# EAGLE schematic MainFeeder_V1.0 (EAGLE 9.5.2)
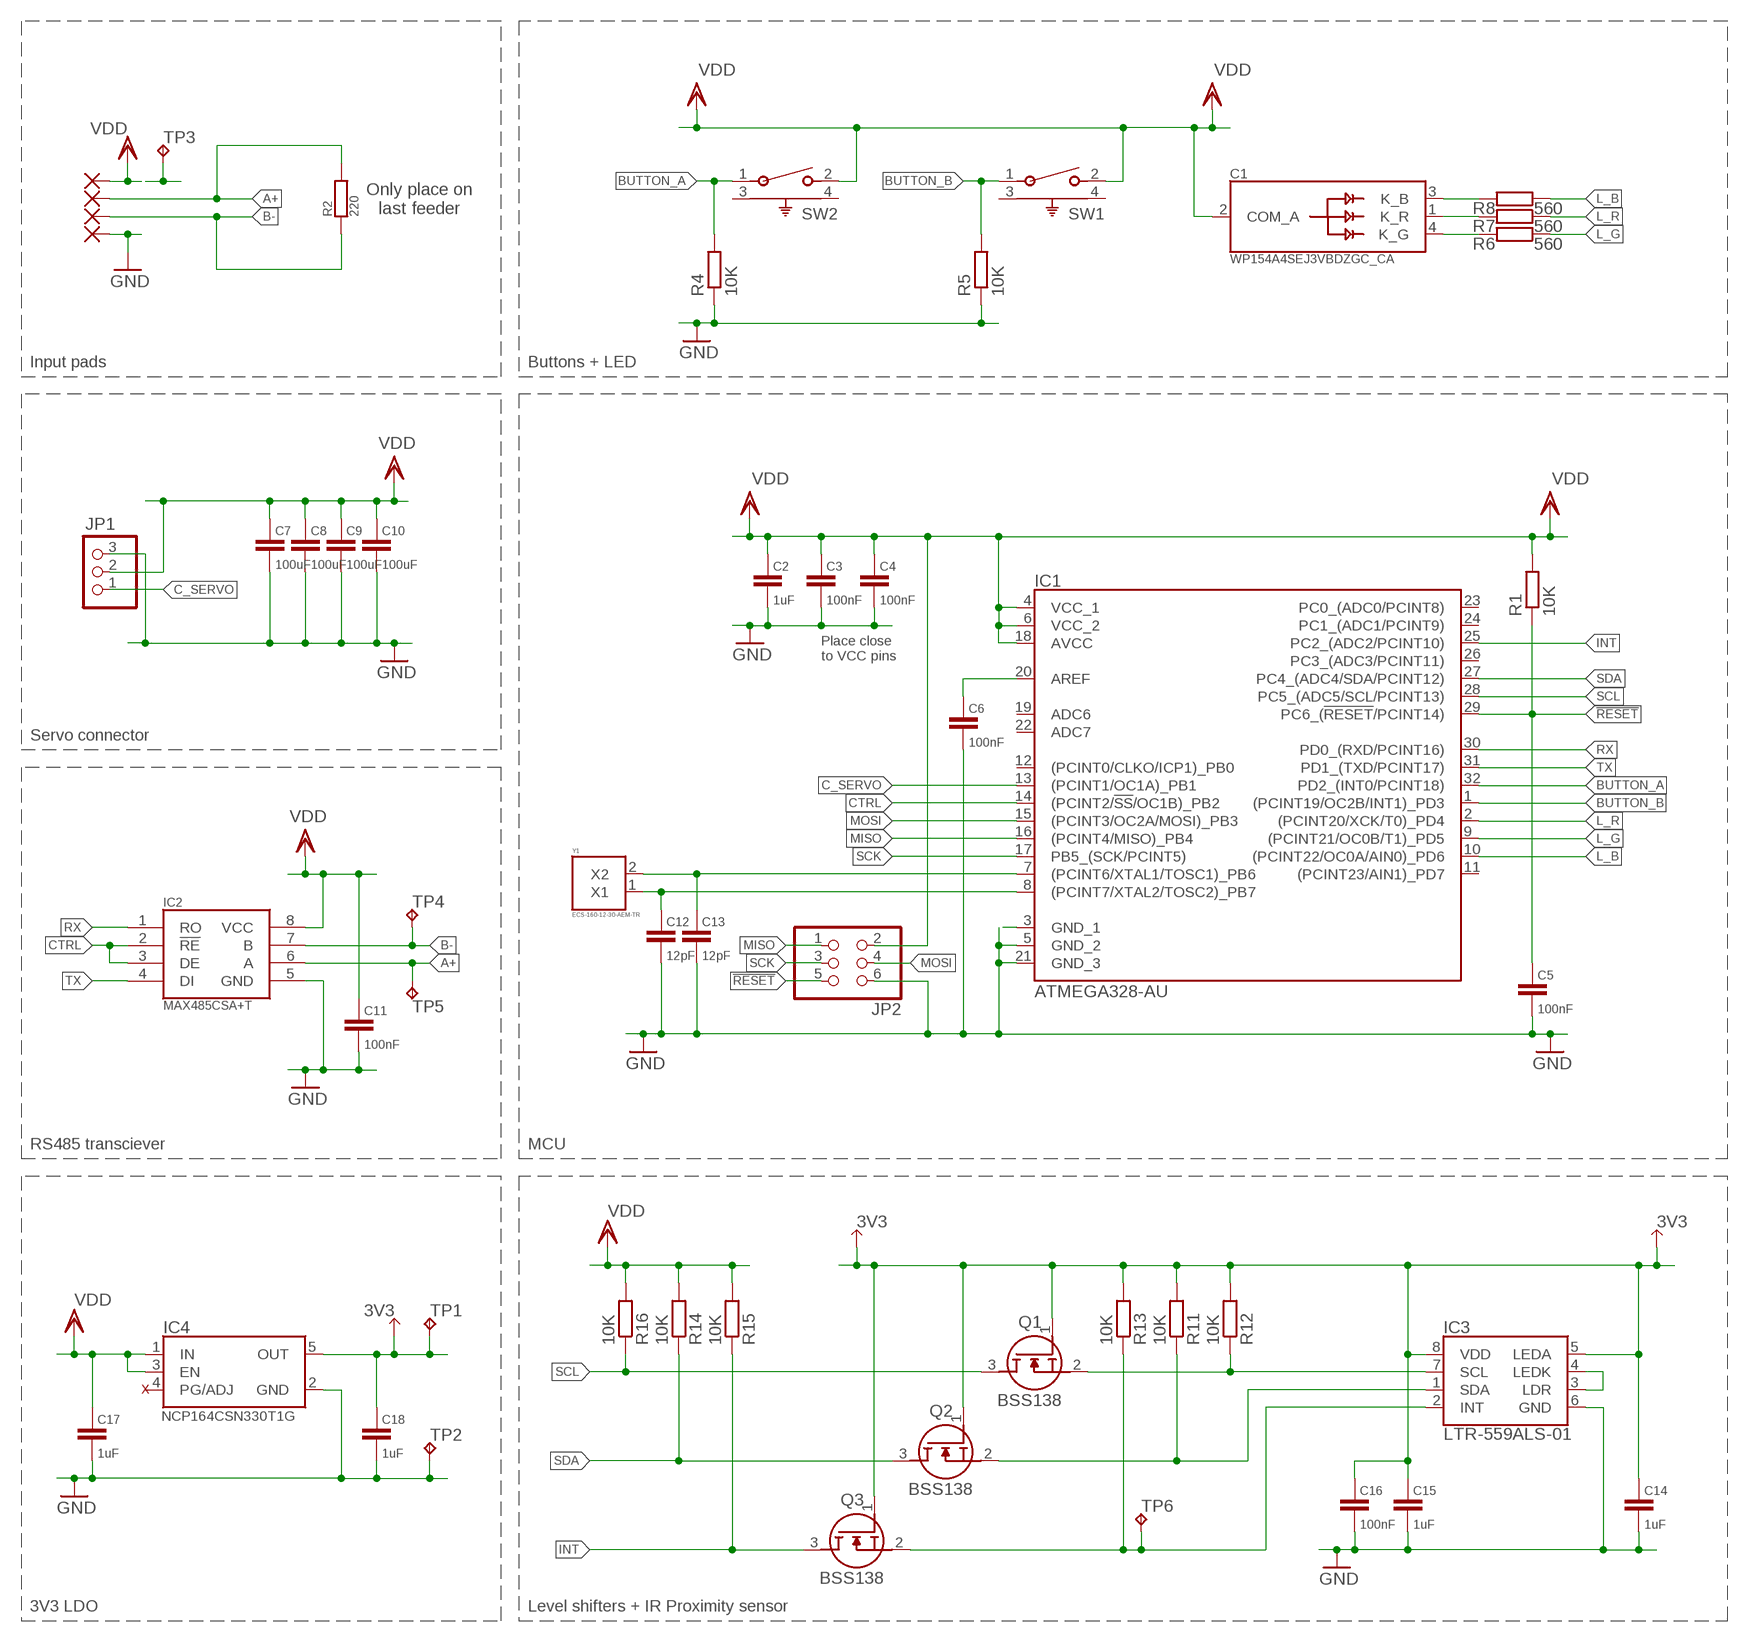
[diagram p0: schematic, sheet 1]

## Parts
C1  WP154A4SEJ3VBDZGC_CA  [L-154A4SUREQBFZGEC]
C2  1uF  C-EUC0603  [C0603]
C3  100nF  C-EUC0603  [C0603]
C4  100nF  C-EUC0603  [C0603]
C5  100nF  C-EUC0603  [C0603]
C6  100nF  C-EUC0603  [C0603]
C7  100uF  C-EUC0805  [C0805]
C8  100uF  C-EUC0805  [C0805]
C9  100uF  C-EUC0805  [C0805]
C10  100uF  C-EUC0805  [C0805]
C11  100nF  C-EUC0603  [C0603]
C12  12pF  C-EUC0603  [C0603]
C13  12pF  C-EUC0603  [C0603]
C14  1uF  C-EUC0603  [C0603]
C15  1uF  C-EUC0603  [C0603]
C16  100nF  C-EUC0603  [C0603]
C17  1uF  C-EUC0603  [C0603]
C18  1uF  C-EUC0603  [C0603]
IC1  ATMEGA328-AU  [QFP80P900X900X120-32N]
IC2  MAX485CSA+T  [SOIC127P600X175-8N]
IC3  LTR-559ALS-01  [LTR559ALS01]
IC4  NCP164CSN330T1G  [SOT95P275X110-5N]
JP1  PINHD-1X3/90  [1X03/90]
JP2  PINHD-2X3  [2X03]
PAD1  SMD2  [SMD1,27-2,54]
PAD2  SMD2  [SMD1,27-2,54]
PAD3  SMD2  [SMD1,27-2,54]
PAD4  SMD2  [SMD1,27-2,54]
Q1  BSS138  [SOT95P240X120-3N]
Q2  BSS138  [SOT95P240X120-3N]
Q3  BSS138  [SOT95P240X120-3N]
R1  10K  R-EU_R0603  [R0603]
R2  220  R-EU_R0603  [R0603]
R4  10K  R-EU_R0603  [R0603]
R5  10K  R-EU_R0603  [R0603]
R6  560  R-EU_R0603  [R0603]
R7  560  R-EU_R0603  [R0603]
R8  560  R-EU_R0603  [R0603]
R11  10K  R-EU_R0603  [R0603]
R12  10K  R-EU_R0603  [R0603]
R13  10K  R-EU_R0603  [R0603]
R14  10K  R-EU_R0603  [R0603]
R15  10K  R-EU_R0603  [R0603]
R16  10K  R-EU_R0603  [R0603]
SW1  1-1825027-1  [SW2_1825027-A_TEC]
SW2  1-1825027-1  [SW2_1825027-A_TEC]
TP1  TPB1,27  [B1,27]
TP2  TPB1,27  [B1,27]
TP3  TPB1,27  [B1,27]
TP4  TPB1,27  [B1,27]
TP5  TPB1,27  [B1,27]
TP6  TPB1,27  [B1,27]
Y1  ECS-160-12-30-AEM-TR  [ECS1601230AEMTR]

## Nets
3V3: C14.1 C15.1 C16.1 C18.1 IC3.5(LEDA) IC3.8(VDD) IC4.5(OUT) Q1.1(G) Q2.1(G) Q3.1(G) R11.2 R12.2 R13.2 TP1.TP
!RESET: C5.1 IC1.29(PC6_(!RESET!/PCINT14)) JP2.5 R1.1
A+: IC2.6(A) PAD1.1(P) R2.2 TP5.TP
B-: IC2.7(B) PAD2.1(P) R2.1 TP4.TP
BUTTON_A: IC1.32(PD2_(INT0/PCINT18)) R4.2 SW2.1
BUTTON_B: IC1.1((PCINT19/OC2B/INT1)_PD3) R5.2 SW1.1
C_SERVO: IC1.13((PCINT1/OC1A)_PB1) JP1.1
CTRL: IC1.14((PCINT2/!SS!/OC1B)_PB2) IC2.2(!RE) IC2.3(DE)
GND: C2.2 C3.2 C4.2 C5.2 C6.2 C7.2 C8.2 C9.2 C10.2 C11.2 C12.2 C13.2 C14.2 C15.2 C16.2 C17.2 C18.2 IC1.3(GND_1) IC1.5(GND_2) IC1.21(GND_3) IC2.5(GND) IC3.6(GND) IC4.2(GND) JP1.3 JP2.6 PAD3.1(P) R4.1 R5.1 TP2.TP
INT: IC1.25(PC2_(ADC2/PCINT10)) Q3.3(D) R15.1
INT_3V3: IC3.2(INT) Q3.2(S) R13.1 TP6.TP
L_B: IC1.10((PCINT22/OC0A/AIN0)_PD6) R8.1
L_G: IC1.9((PCINT21/OC0B/T1)_PD5) R6.1
L_R: IC1.2((PCINT20/XCK/T0)_PD4) R7.1
MISO: IC1.16((PCINT4/MISO)_PB4) JP2.1
MOSI: IC1.15((PCINT3/OC2A/MOSI)_PB3) JP2.4
N$1: C6.1 IC1.20(AREF)
N$2: C1.3(K_B) R8.2
N$3: C1.1(K_R) R7.2
N$4: IC3.3(LDR) IC3.4(LEDK)
N$6: C12.1 IC1.8((PCINT7/XTAL2/TOSC2)_PB7) Y1.1(X1)
N$7: C1.4(K_G) R6.2
N$8: C13.1 IC1.7((PCINT6/XTAL1/TOSC1)_PB6) Y1.2(X2)
RX: IC1.30(PD0_(RXD/PCINT16)) IC2.1(RO)
SCK: IC1.17(PB5_(SCK/PCINT5)) JP2.3
SCL: IC1.28(PC5_(ADC5/SCL/PCINT13)) Q1.3(D) R16.1
SCL_3V3: IC3.7(SCL) Q1.2(S) R12.1
SDA: IC1.27(PC4_(ADC4/SDA/PCINT12)) Q2.3(D) R14.1
SDA_3V3: IC3.1(SDA) Q2.2(S) R11.1
TX: IC1.31(PD1_(TXD/PCINT17)) IC2.4(DI)
VDD: C1.2(COM_A) C2.1 C3.1 C4.1 C7.1 C8.1 C9.1 C10.1 C11.1 C17.1 IC1.4(VCC_1) IC1.6(VCC_2) IC1.18(AVCC) IC2.8(VCC) IC4.1(IN) IC4.3(EN) JP1.2 JP2.2 PAD4.1(P) R1.2 R14.2 R15.2 R16.2 SW1.2 SW2.2 TP3.TP
Unconnected: IC1.11((PCINT23/AIN1)_PD7) IC1.12((PCINT0/CLKO/ICP1)_PB0) IC1.19(ADC6) IC1.22(ADC7) IC1.23(PC0_(ADC0/PCINT8)) IC1.24(PC1_(ADC1/PCINT9)) IC1.26(PC3_(ADC3/PCINT11)) IC4.4(PG/ADJ) SW1.3 SW1.4 SW2.3 SW2.4

## Notes on the sheet
- Only place on
  last feeder
- Input pads | Buttons + LED
- Place close
  to VCC pins
- Servo connector
- RS485 transciever | MCU
- X
- 3V3 LDO | Level shifters + IR Proximity sensor

## Library data of the parts
C1 = SamacSys_Parts:WP154A4SEJ3VBDZGC_CA: Standard LEDs - Through Hole 5MM RGB LED Source: Datasheet <http://www.kingbrightusa.com/images/catalog/SPEC/WP154A4SEJ3VBDZGC-CA.pdf>; DESCRIPTION: Standard LEDs - Through Hole 5MM RGB LED; HEIGHT: mm; MANUFACTURER_NAME: Kingbright; MANUFACTURER_PART_NUMBER: WP154A4SEJ3VBDZGC/CA; MOUSER_PART_NUMBER: 604-WP154A43VBDZGCCA; MOUSER_PRICE-STOCK: https://www.mouser.co.uk/ProductDetail/Kingbright/WP154A4SEJ3VBDZGC-CA?qs=YCa%2FAAYMW01T13YiwBKGSw%3D%3D
C2-C18 = rcl:C-EU: CAPACITOR, European symbol; SPICEPREFIX: C
IC1 = SamacSys_Parts:ATMEGA328-AU: MCU 8-Bit AVR 32KB Flash 2.5/3.3/5V ATMEGA328-AU, 8 bit AVR Microcontroller 20MHz 32 kB Flash, 1 kB, 2 kB RAM, I2C 32-Pin TQFP Source: Datasheet <http://www.atmel.com/images/atmel-8271-8-bit-avr-microcontroller-atmega48a-48pa-88a-88pa-168a-168pa-328-328p_datasheet_summary.pdf>; DESCRIPTION: MCU 8-Bit AVR 32KB Flash 2.5/3.3/5V ATMEGA328-AU, 8 bit AVR Microcontroller 20MHz 32 kB Flash, 1 kB, 2 kB RAM, I2C 32-Pin TQFP; HEIGHT: 1.2mm; MANUFACTURER_NAME: Microchip; MANUFACTURER_PART_NUMBER: ATMEGA328-AU; MOUSER_PART_NUMBER: 556-ATMEGA328-AU; MOUSER_PRICE-STOCK: https://www.mouser.co.uk/ProductDetail/Microchip-Technology-Atmel/ATMEGA328-AU?qs=lwdSMh1%2FoYJRHuGBjWz9Pg%3D%3D
IC2 = SamacSys_Parts:MAX485CSA+T: RS-422/RS-485 Interface IC Low-Power, Slew-Rate-Limited RS-485/RS-422 Transceivers Source: Datasheet <https://datasheets.maximintegrated.com/en/ds/MAX1487-MAX491.pdf>; DESCRIPTION: RS-422/RS-485 Interface IC Low-Power, Slew-Rate-Limited RS-485/RS-422 Transceivers; HEIGHT: 1.75mm; MANUFACTURER_NAME: Maxim Integrated; MANUFACTURER_PART_NUMBER: MAX485CSA+T; MOUSER_PART_NUMBER: 700-MAX485CSAT; MOUSER_PRICE-STOCK: https://www.mouser.co.uk/ProductDetail/Maxim-Integrated/MAX485CSA%2bT?qs=LHmEVA8xxfYLnNxfn7yuwQ%3D%3D
IC3 = SamacSys_Parts:LTR-559ALS-01: Light to Digital Converters Ambient Light Photo Sensor Source: Datasheet <https://optoelectronics.liteon.com/upload/download/DS86-2013-0003/LTR-559ALS-01_DS_V1.pdf>; DESCRIPTION: Light to Digital Converters Ambient Light Photo Sensor; HEIGHT: 1.5mm; MANUFACTURER_NAME: Lite-On; MANUFACTURER_PART_NUMBER: LTR-559ALS-01; MOUSER_PART_NUMBER: 859-LTR559ALS01; MOUSER_PRICE-STOCK: https://www.mouser.co.uk/ProductDetail/Lite-On/LTR-559ALS-01?qs=g5ciJ0jwZaFszfH9HZ6uUw%3D%3D
IC4 = SamacSys_Parts:NCP164CSN330T1G: LDO Regulator Pos 3.3V 0.3A 5-Pin TSOP T/R Source: Datasheet <https://componentsearchengine.com/Datasheets/2/NCP164CSN330T1G.pdf>; DESCRIPTION: LDO Regulator Pos 3.3V 0.3A 5-Pin TSOP T/R; HEIGHT: 1.1mm; MANUFACTURER_NAME: ON Semiconductor; MANUFACTURER_PART_NUMBER: NCP164CSN330T1G; MOUSER_PART_NUMBER: 863-NCP164CSN330T1G; MOUSER_PRICE-STOCK: https://www.mouser.co.uk/ProductDetail/ON-Semiconductor/NCP164CSN330T1G?qs=xZ%2FP%252Ba9zWqbi%2FAyy5UtoRw%3D%3D
JP1 = pinhead:PINHD-1X3: PIN HEADER
JP2 = pinhead:PINHD-2X3: PIN HEADER
PAD1-PAD4 = wirepad:SMD2: SMD PAD
Q1-Q3 = SamacSys_Parts:BSS138: N-channel MOSFET,BSS138 0.2A 50V Source: Datasheet <https://www.onsemi.com/pub/Collateral/BSS138-D.PDF>; DESCRIPTION: N-channel MOSFET,BSS138 0.2A 50V; HEIGHT: 1.2mm; MANUFACTURER_NAME: ON Semiconductor; MANUFACTURER_PART_NUMBER: BSS138; MOUSER_PART_NUMBER: 512-BSS138; MOUSER_PRICE-STOCK: https://www.mouser.co.uk/ProductDetail/ON-Semiconductor-Fairchild/BSS138?qs=HK%252BeIG1iaahCeqBvjB4arg%3D%3D
R1 R2 R4-R8 R11-R16 = rcl:R-EU_: RESISTOR, European symbol; SPICEPREFIX: R
SW1 SW2 = PNPFeeder:1-1825027-1; BUILT_BY: EMA_UL_Team; CONFIGURATION__POLE-THROW_: Single Pole - Single Throw; CONTACT_CURRENT_RATING: 50; COPYRIGHT: Copyright (C) 2016 Accelerated Designs. All rights reserved; DESCRIPTION: FSMRA4JH04=R/A,TACT PB SW,160G; MANUFACTURER_PART_NUMBER: 1-1825027-1; MAX_SWITCHING_CURRENT: -; MAX_SWITCHING_VOLTAGE_AC_: -; PRODUCT_TYPE: Switch; SOURCELIBRARY: TE_Connectivity-2018-03-16; SWITCH_TYPE: Tactile Switches; TE_INTERNAL_NUMBER: 1-1825027-1; TE_PART_NUMBER: 1-1825027-1; VENDOR: TE Connectivity; VOLTAGE_RATING: -
TP1-TP6 = testpad:TP: Test pad
Y1 = SamacSys_Parts:ECS-160-12-30-AEM-TR: ECX-53 SMD CRYSTAL Source: Datasheet; DESCRIPTION: ECX-53 SMD CRYSTAL; HEIGHT: 1.4mm; MANUFACTURER_NAME: ECS; MANUFACTURER_PART_NUMBER: ECS-160-12-30-AEM-TR; MOUSER_PART_NUMBER: 520-160-12-30-AEM-TR; MOUSER_PRICE-STOCK: https://www.mouser.co.uk/ProductDetail/ECS/ECS-160-12-30-AEM-TR?qs=DRkmTr78QAR%252BNhBpMq%2FA3Q%3D%3D